# EAGLE design 555 piano (EAGLE 6.1)
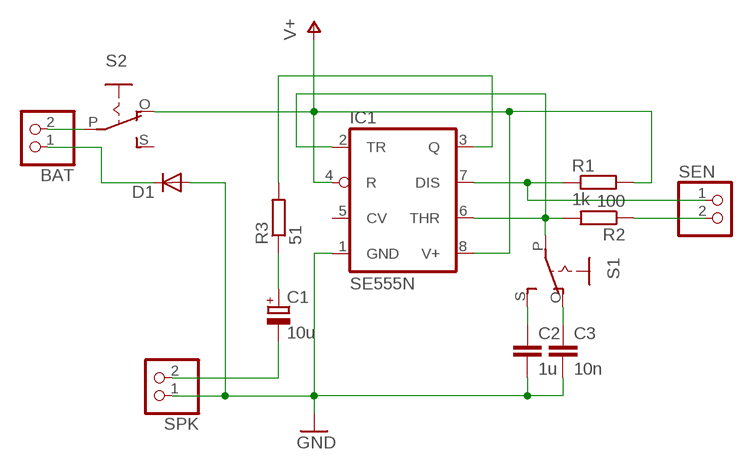
[diagram p0: schematic, sheet 1]

## Parts
BAT  PINHD-1X2  [1X02]
C1  10u  CPOL-EUTT2D5L  [TT2D5L]
C2  1u  C-EU025-025X050  [C025-025X050]
C3  10n  C-EU025-025X050  [C025-025X050]
D1  DIODE-D-5  [D-5]
IC1  SE555N  [DIL08-ROUND]
R1  1k  R-EU_0204/7  [0204/7]
R2  100  R-EU_0204/7  [0204/7]
R3  51  R-EU_0204/7  [0204/7]
S1  EG1218S  [EG1218]
S2  EG1218S  [EG1218]
SEN  PINHD-1X2  [1X02]
SPK  PINHD-1X2  [1X02]

## Nets
GND: C2.2 C3.2 D1.A IC1.1(GND) SPK.1
N$1: C1.- SPK.2
N$2: IC1.7(DIS) R1.1 SEN.1
N$3: IC1.3(Q) R3.2
N$4: C1.+ R3.1
N$5: R2.1 SEN.2
N$6: IC1.2(TR) IC1.6(THR) R2.2 S1.P
N$7: C2.1 S1.S
N$8: C3.1 S1.O
N$9: BAT.1 D1.C
N$10: BAT.2 S2.P
V+: IC1.4(R) IC1.8(V+) R1.2 S2.O
Unconnected: IC1.5(CV) S2.S

## Library data of the parts
BAT SEN SPK = pinhead:PINHD-1X2: PIN HEADER
C1 = rcl:CPOL-EU: POLARIZED CAPACITOR, European symbol
C2 C3 = rcl:C-EU: CAPACITOR, European symbol
D1 = diode:DIODE-: DIODE
IC1 = adafruit:*555: TIMER Changed DIP package to have round (not oval) pin pads http://www.ladyada.net/library/pcb/eaglelibrary.html
R1-R3 = rcl:R-EU_: RESISTOR, European symbol
S1 S2 = _MY_OWN_LIB:EG1218: SLIDING SWITCH 0.1" spacing through hole, vertical SPDT slide switch http://www.ladyada.net/library/pcb/eaglelibrary.html

## Board
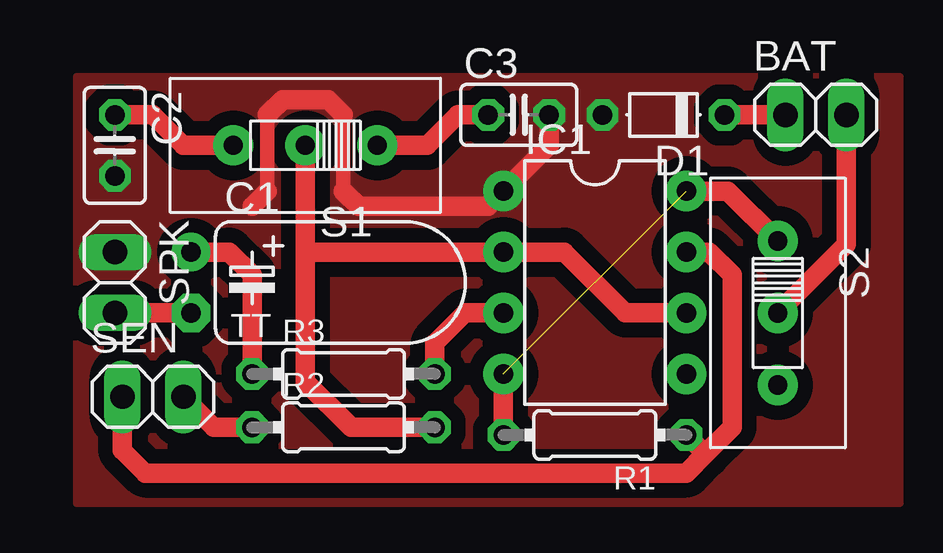
[diagram p1: board, top side]

No outline drawn. Coordinates in mm, seen from the top.
Copper layers (1*16): Top 0.035mm / dielectric 1.5mm / Bottom 0.035mm
Design rules: minimum track width 10mil, minimum drill 24mil, track to track 12mil, track to pad 12mil, pad to pad 12mil, via to via 12mil, smd to smd 10mil, copper to edge 12mil, drill to drill 12mil, minimum pad ring 10mil, minimum via ring 10mil, stop-mask expansion 4mil, vias tented up to drill 0mil, thermal gap 12mil

### Footprints (pad centres in the part's own frame; a part is rotated, then mirrored left to right if it is on the bottom)
1X02 = drill 1.016 long: 1 -1.27,0; 2 1.27,0
TT2D5L = drill 0.813 pad 1.6: + -1.27,0 | drill 0.813 pad 1.6 octagon: - 1.27,0
C025-025X050 = drill 0.813 octagon: 1 -1.27,0; 2 1.27,0
D-5 = drill 0.813 octagon: A 2.54,0; C -2.54,0
DIL08-ROUND = drill 0.813 pad 1.676: 1 -3.81,-3.81; 2 -1.27,-3.81; 3 1.27,-3.81; 4 3.81,-3.81; 5 3.81,3.81; 6 1.27,3.81; 7 -1.27,3.81; 8 -3.81,3.81
0204/7 = drill 0.813 octagon: 1 -3.81,0; 2 3.81,0
EG1218 = drill 0.8 pad 1.676: O -3,0; P 0,0; S 3,0

### Placement (x,y rotation side)
BAT  14.29,6.99 0 top
C1  -11.75,0 270 top
C2  -14.92,5.71 270 top
C3  1.91,6.99 0 top
D1  7.94,6.99 180 top
IC1  5.08,0 270 top
R1  5.08,-6.35 180 top
R2  -5.4,-6.03 0 top
R3  -5.4,-3.81 0 top
S1  -6.99,5.71 180 top
S2  12.7,-1.27 270 top
SEN  -13.34,-4.76 0 top
SPK  -14.92,0 270 top

### Tracks (layer width: path | path; a pad name or v marks a point on that pad's centre or on a via)
GND
  Top 0.61: -8.57,6.99 -8.57,3.81 | -5.4,6.99 -5.4,3.81
  Top 0.813: -9.21,3.17 -8.57,3.81 | -8.57,6.99 -7.94,7.62 -6.03,7.62 -5.4,6.99 | -5.4,3.81 -4.76,3.17 0.64,3.17 IC1.1 3.17,5.71 C3.2
  pour Top (isolate 0.61, no thermals): -16.51,8.57 17.78,8.57 17.78,-9.21 -16.51,-9.21
N$1
  Top 0.813: SPK.2 C1.-
N$2
  Top 0.813: IC1.7 9.84,1.27 10.79,0.32 10.79,-6.03 9.68,-7.14 | 9.68,-7.14 8.89,-7.94 -13.65,-7.94 -14.61,-6.99 SEN.1 | R1.1 9.68,-7.14
N$3
  Top 0.813: R3.2 -1.59,-2.54 -0.32,-1.27 IC1.3
N$4
  Top 0.813: C1.+ -10.16,1.27 -9.21,0.32 R3.1
N$5
  Top 0.813: SEN.2 -10.79,-6.03 R2.1
N$6
  Top 0.813: IC1.6 6.35,-1.27 3.81,1.27 IC1.2 -6.99,1.27 | S1.P -6.99,1.27 | -6.99,1.27 -6.99,-4.13 -5.08,-6.03 R2.2
N$7
  Top 0.813: C2.1 -13.34,6.99 -12.06,5.71 S1.S
N$8
  Top 0.813: S1.O -1.91,5.71 -0.64,6.99 C3.1
N$9
  Top 0.813: D1.C BAT.1
N$10
  Top 0.813: BAT.2 15.56,1.59 S2.P
V+  (1 unrouted)
  Top 0.813: IC1.4 R1.2 | S2.O 10.62,3.81 IC1.8